# EAGLE design uStar (EAGLE 7.5.0)
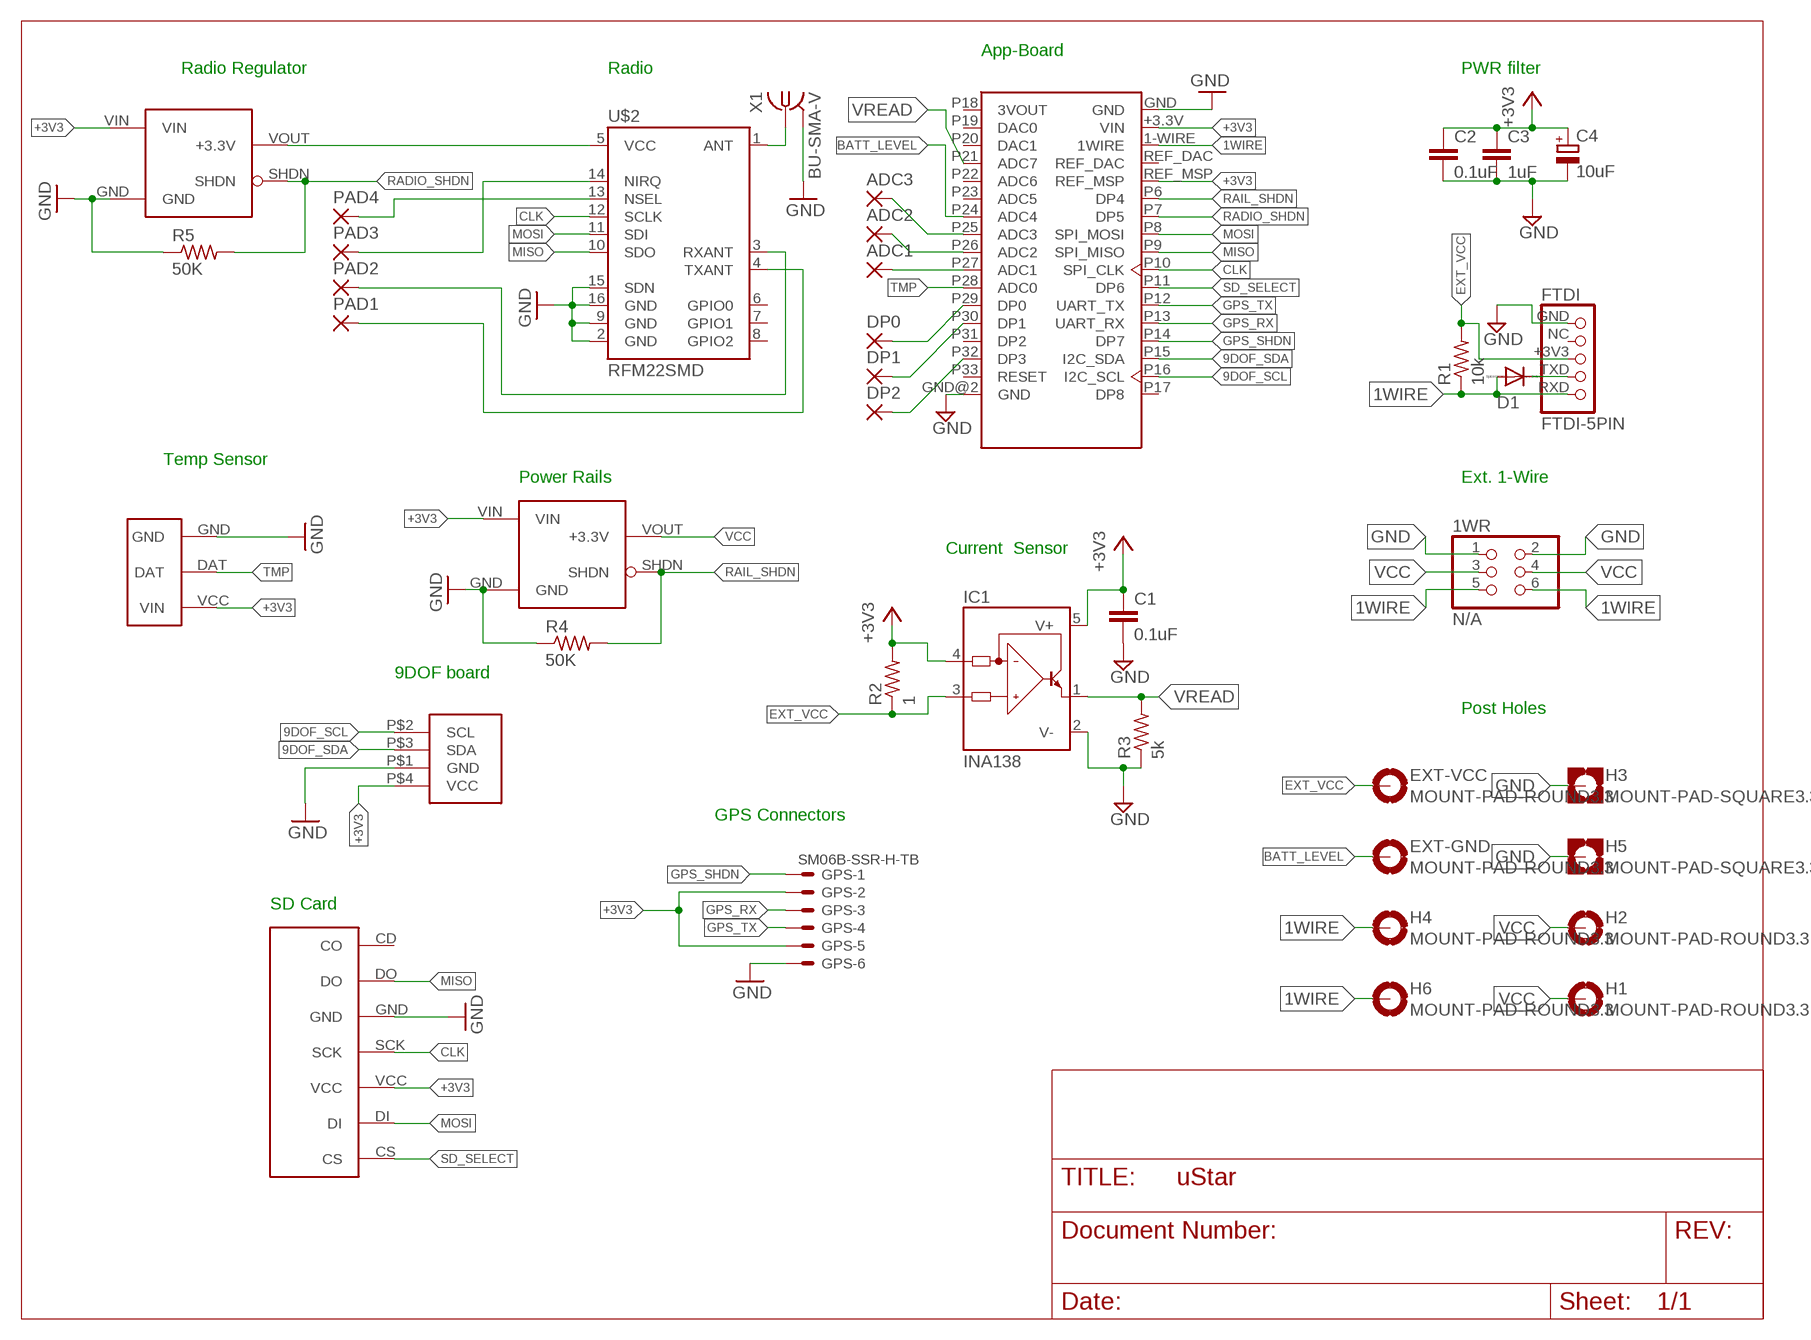
[diagram p0: schematic, sheet 1]

## Parts
1WR  N/A  PINHD-2X3  [2X03]
ADC1  1,6/0,9  [1,6/0,9]
ADC2  1,6/0,9  [1,6/0,9]
ADC3  1,6/0,9  [1,6/0,9]
C1  0.1uF  C-EUC0805  [C0805]
C2  0.1uF  C-EUC0603  [C0603]
C3  1uF  C-EUC0603  [C0603]
C4  10uF  CPOL-EUSMCB  [SMC_B]
D1  1N4148DO35-7  [DO35-7]
DP0  1,6/0,9  [1,6/0,9]
DP1  1,6/0,9  [1,6/0,9]
DP2  1,6/0,9  [1,6/0,9]
EXT-GND  MOUNT-PAD-ROUND3.3  [3,3-PAD]
EXT-VCC  MOUNT-PAD-ROUND3.3  [3,3-PAD]
FTDI  FTDI-5PIN  [1_05X2MM]
GPS  SM06B-SSR-H-TB  [SM06B-SSR-H-TB]
H1  MOUNT-PAD-ROUND3.3  [3,3-PAD]
H2  MOUNT-PAD-ROUND3.3  [3,3-PAD]
H3  MOUNT-PAD-SQUARE3.3  [3,3-PAD-SQUARE]
H4  MOUNT-PAD-ROUND3.3  [3,3-PAD]
H5  MOUNT-PAD-SQUARE3.3  [3,3-PAD-SQUARE]
H6  MOUNT-PAD-ROUND3.3  [3,3-PAD]
IC1  INA138  [SOT23-5]
PAD1  1,6/0,9  [1,6/0,9]
PAD2  1,6/0,9  [1,6/0,9]
PAD3  1,6/0,9  [1,6/0,9]
PAD4  1,6/0,9  [1,6/0,9]
R1  10k  R-US_0207/7  [0207/7]
R2  1  R-US_R0603  [R0603]
R3  5k  R-US_R0603  [R0603]
R4  50K  R-US_R0603  [R0603]
R5  50K  R-US_R0603  [R0603]
U$1  App-Board 1.2/1.3  APP_CORE  [APPCORE_RECEIVER]
U$2  RFM22SMD  [RFM22-XXX-S2]
U$3  S7V8F3_VOLT_REG-3V3_1AHORZ-DOWN  [S7V_DOWN]
U$4  TMP_EXT  [TMP_EXT]
U$5  9DOF  [9DOF]
U$6  SDCARD_EXT  [SDCARD_EXT]
U$7  S7V8F3_VOLT_REG-3V3_1AHORZ-DOWN  [S7V_DOWN]
X1  BU-SMA-V  [BU-SMA-V]

## Nets
1WIRE: 1WR.5 1WR.6 D1.A FTDI.RXD H4.B3,3(MOUNT) H6.B3,3(MOUNT) R1.1 U$1.1-WIRE(1WIRE)
9DOF_SCL: U$1.P16(I2C_SCL) U$5.P$2(SCL)
9DOF_SDA: U$1.P15(I2C_SDA) U$5.P$3(SDA)
+3V3: C1.1 C2.1 C3.1 C4.+ GPS.2 GPS.5 IC1.4(IN-) IC1.5(V+) R2.2 U$1.+3.3V(VIN) U$1.REF_MSP U$3.VIN U$4.VCC(VIN) U$5.P$4(VCC) U$6.VCC U$7.VIN
BATT_LEVEL: EXT-GND.B3,3(MOUNT) U$1.P24(ADC4)
CLK: U$1.P10(SPI_CLK) U$2.12(SCLK) U$6.SCK
EXT_VCC: EXT-VCC.B3,3(MOUNT) FTDI.+3V3 IC1.3(IN+) R1.2 R2.1
GND: 1WR.1 1WR.2 C1.2 C2.2 C3.2 C4.- FTDI.GND GPS.6 H3.B3,3(MOUNT) H5.B3,3(MOUNT) IC1.2(V-) R3.1 R4.1 R5.1 U$1.GND U$1.GND@2(GND) U$2.2(GND) U$2.9(GND) U$2.15(SDN) U$2.16(GND) U$3.GND U$4.GND U$5.P$1(GND) U$6.GND U$7.GND X1.2 X1.3 X1.4 X1.5
GPS_RX: GPS.3 U$1.P13(UART_RX)
GPS_SHDN: GPS.1 U$1.P14(DP7)
GPS_TX: GPS.4 U$1.P12(UART_TX)
MISO: U$1.P9(SPI_MISO) U$2.10(SDO) U$6.DO
MOSI: U$1.P8(SPI_MOSI) U$2.11(SDI) U$6.DI
N$1: PAD1.1(P) U$2.4(TXANT)
N$2: PAD2.1(P) U$2.3(RXANT)
N$3: D1.C FTDI.TXD
N$4: PAD3.1(P) U$2.14(NIRQ)
N$5: PAD4.1(P) U$2.13(NSEL)
N$6: U$2.1(ANT) X1.1
N$7: U$2.5(VCC) U$3.VOUT(+3.3V)
N$8: ADC1.1(P) U$1.P27(ADC1)
N$9: ADC2.1(P) U$1.P26(ADC2)
N$10: ADC3.1(P) U$1.P25(ADC3)
N$11: DP0.1(P) U$1.P29(DP0)
N$12: DP1.1(P) U$1.P30(DP1)
N$13: DP2.1(P) U$1.P32(DP3)
RADIO_SHDN: R5.2 U$1.P7(DP5) U$3.SHDN
RAIL_SHDN: R4.2 U$1.P6(DP4) U$7.SHDN
SD_SELECT: U$1.P11(DP6) U$6.CS
TMP: U$1.P28(ADC0) U$4.DAT
VCC: 1WR.3 1WR.4 H1.B3,3(MOUNT) H2.B3,3(MOUNT) U$7.VOUT(+3.3V)
VREAD: IC1.1(OUT) R3.2 U$1.P21(ADC7)
Unconnected: FTDI.NC U$1.P17(DP8) U$1.P18(3VOUT) U$1.P19(DAC0) U$1.P20(DAC1) U$1.P22(ADC6) U$1.P23(ADC5) U$1.P31(DP2) U$1.P33(RESET) U$1.REF_DAC U$2.6(GPIO0) U$2.7(GPIO1) U$2.8(GPIO2) U$6.CD(CO)

## Notes on the sheet
- App-Board
- Radio Regulator | Radio | PWR filter
- Temp Sensor
- Power Rails | Ext. 1-Wire
- Current  Sensor
- 9DOF board
- Post Holes
- GPS Connectors
- SD Card

## Library data of the parts
1WR = pinhead:PINHD-2X3: PIN HEADER
ADC1-ADC3 DP0 DP1 DP2 PAD1-PAD4 = wirepad:1,6/0,9: THROUGH-HOLE PAD
C1-C3 = resistor:C-EU: CAPACITOR, European symbol
C4 = resistor:CPOL-EU: POLARIZED CAPACITOR, European symbol
D1 = diode:1N4148: DIODE high speed (Philips)
EXT-GND EXT-VCC H1 H2 H4 H6 = holes:MOUNT-PAD-ROUND: MOUNTING PAD, round
FTDI = FTDI:FTDI-5PIN
GPS = con-jst2:SM06B-SSR-H-TB: Disconnectable Insulation displacement connector, 1.0mm pitch 6 contacts
H3 H5 = holes:MOUNT-PAD-SQUARE: MOUNTING PAD, square
IC1 = burr-brown:INA138: High-Side Measurement Current Shunt Monitor; MF: TEXAS INSTRUMENTS; MPN: INA138NA/250; OC_FARNELL: 1564888; OC_NEWARK: 80K5906
R1-R3 = resistor:R-US_: RESISTOR, American symbol
R4 R5 = rcl:R-US_: RESISTOR, American symbol
U$1 = LearningByMaking2:APP_CORE
U$2 = SparkFun-RF:RFM22: The RFM22 is a low-power, low cost radio that is capable of operating in the 434MHz and 900MHz open bands. It's frequency is software defined and there are some very good libraries written for it.
U$3 U$7 = Pololu:S7V8F3_VOLT_REG-3V3_1A
U$4 = LearningByMaking:TMP_EXT
U$5 = LearningByMaking:9DOF
U$6 = LearningByMaking:SDCARD_EXT
X1 = con-coax:BU-SMA-V: FEMALE SMA CONNECTOR Radiall distributor RS 112-3794; OC_FARNELL: unknown; OC_NEWARK: unknown

## Board
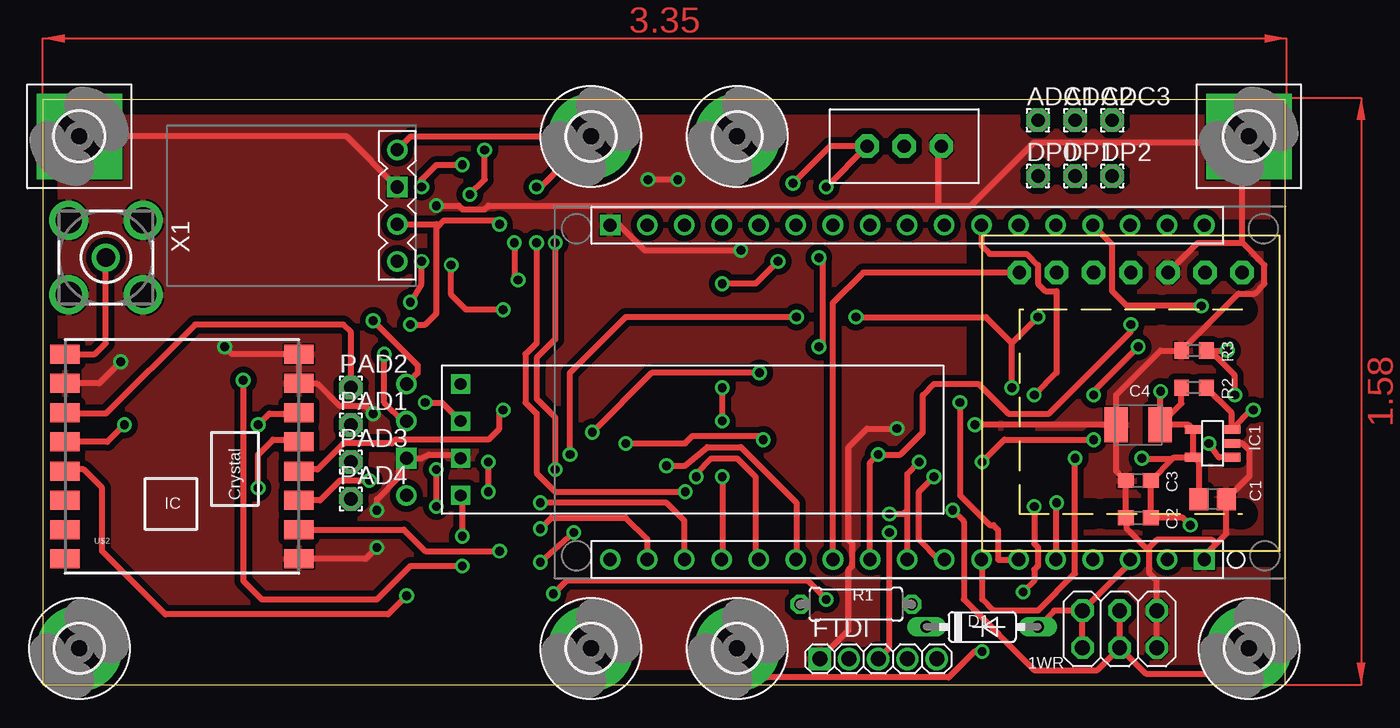
[diagram p1: board, top side]
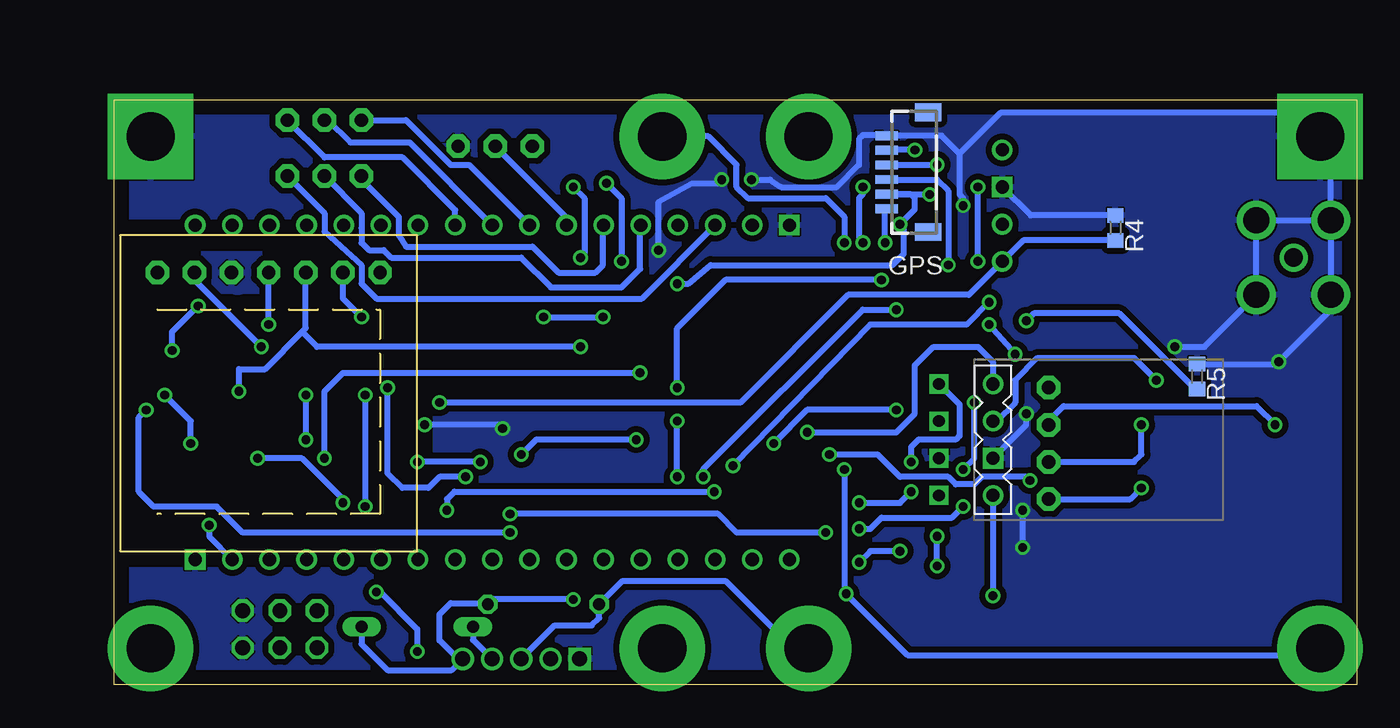
[diagram p2: board, bottom side, seen from below]

Size 85 x 40 mm. Coordinates in mm from the lower left corner, seen from the top.
Outline: 0,0 85,0 85,40 0,40 0,0
Copper layers (1*16): Top 0.035mm / dielectric 1.5mm / Bottom 0.035mm
Design rules "default *": minimum track width 10mil, minimum drill 19mil, track to track 8mil, track to pad 8mil, pad to pad 8mil, via to via 8mil, smd to smd 8mil, copper to edge 40mil, drill to drill 8mil, minimum pad ring 10mil, minimum via ring 8mil, stop-mask expansion 4mil, vias tented up to drill 0mil, thermal gap 5mil

### Footprints (pad centres in the part's own frame; a part is rotated, then mirrored left to right if it is on the bottom)
2X03 = drill 1.016 octagon: 1 -2.54,-1.27; 2 -2.54,1.27; 3 0,-1.27; 4 0,1.27; 5 2.54,-1.27; 6 2.54,1.27
1,6/0,9 = drill 0.914 pad 1.6 octagon: 1 0,0
C0805 = smd 1.3 x 1.5: 1 -0.95,0; 2 0.95,0
C0603 = smd 1.1 x 1: 1 -0.85,0; 2 0.85,0
SMC_B = smd 1.6 x 2.4: + -1.5,0; - 1.5,0
DO35-7 = drill 0.813 long: A 3.81,0; C -3.81,0
3,3-PAD = drill 3.3 pad 5.842: B3,3 0,0
1_05X2MM = drill 1.016 pad 1.3: +3V3 0,0; NC -2,0; RXD 4,0; TXD 2,0 | drill 1.016 pad 1.3 square: GND -4,0
SM06B-SSR-H-TB = smd 0.6 x 1.55: 1 -2.5,1.925; 2 -1.5,1.925; 3 -0.5,1.925; 4 0.5,1.925; 5 1.5,1.925; 6 2.5,1.925 | smd 1.2 x 1.8: FIT@1 -4.1,-0.9; FIT@2 4.1,-0.9
3,3-PAD-SQUARE = drill 3.3 pad 5.842 square: B3,3 0,0
SOT23-5 = smd 0.6 x 1.2: 1 -0.95,-1.306; 2 0,-1.306; 3 0.95,-1.306; 4 0.95,1.306; 5 -0.95,1.306
0207/7 = drill 0.813 octagon: 1 -3.81,0; 2 3.81,0
R0603 = smd 1 x 1.1: 1 -0.85,0; 2 0.85,0
APPCORE_RECEIVER = drill 0.9: 1-WIRE 11.43,14.37; +3.3V 11.43,16.91; P6 11.43,6.75; P7 11.43,4.21; P8 11.43,1.67; P9 11.43,-0.87; P10 11.43,-3.41; P11 11.43,-5.95; P12 11.43,-8.49; P13 11.43,-11.03; P14 11.43,-13.57; P15 11.43,-16.11; P16 11.43,-18.65; P17 11.43,-21.19; P18 -11.43,19.45; P19 -11.43,16.91; P20 -11.43,14.37; P21 -11.43,11.83; P22 -11.43,9.29; P23 -11.43,6.75; P24 -11.43,4.21; P25 -11.43,1.67; P26 -11.43,-0.87; P27 -11.43,-3.41; P28 -11.43,-5.95; P29 -11.43,-8.49; P30 -11.43,-11.03; P31 -11.43,-13.57; P32 -11.43,-16.11; P33 -11.43,-18.65; REF_DAC 11.43,11.83; REF_MSP 11.43,9.29 | drill 0.9 square: GND 11.43,19.45; GND@2 -11.43,-21.19
RFM22-XXX-S2 = smd 2 x 1.3: 1 -8,7; 2 -8,5; 3 -8,3; 4 -8,1; 5 -8,-1; 6 -8,-3; 7 -8,-5; 8 -8,-7; 9 8,-7; 10 8,-5; 11 8,-3; 12 8,-1; 13 8,1; 14 8,3; 15 8,5; 16 8,7
S7V_DOWN = drill 0.9 square: GND 1.27,-7.23 | drill 0.9: SHDN -3.81,-7.23; VIN -1.27,-7.23; VOUT 3.81,-7.23
TMP_EXT = drill 0.914 pad 1.6 octagon: DAT 0,0; GND 2.54,0; VCC -2.54,0
9DOF = drill 0.8 square: P$1 0,-1.27; P$2 0,1.27; P$3 0,3.81; P$4 0,-3.81
SDCARD_EXT = drill 0.914 pad 1.6 octagon: CD 7.62,-8.89; CS -7.62,-8.89; DI -5.08,-8.89; DO 5.08,-8.89; GND 2.54,-8.89; SCK 0,-8.89; VCC -2.54,-8.89
BU-SMA-V = drill 1.27: 1 0,0 | drill 1.778: 2 -2.55,2.55; 3 2.55,2.55; 4 2.55,-2.55; 5 -2.55,-2.55

### Placement (x,y rotation side)
1WR  73.66,3.81 180 top
ADC1  68.07,38.61 0 top
ADC2  70.61,38.61 0 top
ADC3  73.15,38.61 0 top
C1  80.01,12.7 0 top
C2  74.93,11.43 180 top
C3  74.93,13.97 180 top
C4  74.93,17.78 180 top
D1  64.26,3.96 0 top
DP0  68.07,34.8 0 top
DP1  70.61,34.8 0 top
DP2  73.15,34.8 0 top
EXT-GND  47.5,2.5 0 top
EXT-VCC  37.5,2.5 0 top
FTDI  57.15,1.78 0 top
GPS  30.23,35.05 90 bottom
H1  82.5,2.5 0 top
H2  37.5,37.5 0 top
H3  82.5,37.5 0 top
H4  47.5,37.5 0 top
H5  2.5,37.5 0 top
H6  2.5,2.5 0 top
IC1  80.01,16.51 90 top
PAD1  21.08,17.78 0 top
PAD2  21.08,20.32 0 top
PAD3  21.08,15.24 0 top
PAD4  21.08,12.7 0 top
R1  55.63,5.51 180 top
R2  78.74,20.32 180 top
R3  78.74,22.86 0 top
R4  16.51,31.24 270 bottom
R5  10.92,21.08 270 bottom
U$1  60,20 270 top
U$2  9.53,15.62 0 top
U$3  17.65,16.76 270 bottom
U$4  58.93,36.83 0 top
U$5  28.57,16.76 0 top
U$6  74.42,19.3 180 bottom
U$7  17.02,32.77 90 top
X1  4.32,29.21 270 top

### Tracks (layer width: path | path; a pad name or v marks a point on that pad's centre or on a via)
1WIRE  (via drill 0.6)
  Top 0.406: v35.05,30.23 35.05,23.62 33.78,22.35 33.78,19.56 35.05,18.29 v35.05,14.73 | U$1.1-WIRE 74.37,8.33 1WR.5 | 1WR.5 69.19,5.08 D1.A | 1WR.6 1WR.5 | v53.59,5.84 52.32,7.11 35.81,7.11 v34.92,6.22
  Bottom 0.406: v35.05,30.23 35.05,32 36.32,33.27 41.66,33.27 42.42,34.04 42.42,35.56 44.36,37.5 H4.B3,3 | v35.05,14.73 35.05,6.35 v34.92,6.22 30.73,2.03 2.97,2.03 H6.B3,3 | D1.A 68.07,2.79 66.29,1.02 61.91,1.02 FTDI.RXD 61.47,1.78 62.74,3.05 62.74,4.83 61.98,5.59 59.51,5.59 R1.1 59.11,5.84 v53.59,5.84
9DOF_SCL  (via drill 0.6)
  Top 0.406: U$1.P16 41.35,9.96 39.88,11.43 34.8,11.43 v34.04,10.67 | v26.92,12.19 v26.92,14.73 | v26.16,19.3 27.3,19.3 U$5.P$2
  Bottom 0.406: v34.04,10.67 33.27,10.67 32.51,11.43 27.69,11.43 v26.92,12.19 | v26.16,19.3 26.16,15.49 v26.92,14.73
9DOF_SDA  (via drill 0.6)
  Top 0.406: U$1.P15 43.89,11.23 42.67,12.45 v34.04,12.45 | v30.48,13.21 v30.48,15.24
  Bottom 0.406: v34.04,12.45 31.24,12.45 v30.48,13.21 | 30.48,15.49 v30.48,15.24 30.48,16.26 29.97,16.76 27.43,16.76 27.18,17.02 27.18,19.18 U$5.P$3
+3V3  (via drill 0.6)
  Top 0.406: 77.26,15.45 C3.1 C2.1 77.98,11.43 v78.49,10.92 | 77.26,15.45 77.37,15.56 IC1.5 | IC1.5 IC1.4 78.38,17.78 C4.+ | C4.+ 77.89,19.24 R2.2 | IC1.5 79.06,15.2 C1.1 | C4.+ 76.43,20.04 v76.45,20.07 | U$3.VIN 24.64,18.03 23.37,19.3 v23.37,22.61 | v25.15,24.64 26.16,24.64 26.92,25.4 26.92,31.24 | 26.92,31.24 27.43,31.75 30.99,31.75 v31.24,31.5 | v13.72,20.83 13.72,7.11 14.99,5.84 22.86,5.84 25.15,8.13 v28.7,8.13 | v28.7,10.16 28.7,12.83 U$5.P$4 | U$1.REF_MSP 69.34,8.62 v69.34,12.45 | v75.18,15.49 75.23,15.45 77.26,15.45 | v50.29,28.96 48.77,27.43 v46.48,27.43 | v53.59,34.04 U$4.VCC 53.85,36.83 v51.31,34.29 | v53.09,29.21 53.34,28.96 53.34,23.37 v53.09,23.11 | U$7.VIN 26.92,31.5 26.92,31.24 | v29.21,33.53 30.23,34.54 v30.23,36.58
  Bottom 0.406: v76.45,20.07 76.45,21.59 74.68,21.59 72.14,24.13 | v23.37,22.61 v25.15,24.64 | v13.72,20.83 15.24,22.35 21.84,22.35 23.37,20.83 23.37,19.3 24.64,18.03 U$3.VIN | v28.7,8.13 v28.7,10.16 | v69.34,12.45 69.34,12.7 72.14,15.49 v75.18,15.49 | v50.29,28.96 50.29,33.27 v51.31,34.29 | v46.48,27.43 45.72,27.43 44.2,28.7 31.75,28.7 30.99,29.46 30.99,31.24 v31.24,31.5 30.23,32.51 30.23,33.27 30.48,33.53 32.13,33.53 GPS.2 29.23,33.55 v29.21,33.53 | 72.14,24.13 71.88,24.38 U$6.VCC | v53.59,34.04 52.83,33.27 52.83,29.46 v53.09,29.21 | v53.09,23.11 71.12,23.11 72.14,24.13 | v30.23,36.58 32.13,36.58 GPS.5 | v78.49,10.92 78.49,10.15 U$1.+3.3V
BATT_LEVEL  (via drill 0.6)
  Top 0.406: U$1.P24 64.21,30.02 64.77,29.46 67.31,29.46 68.07,28.7 68.07,27.43 68.58,26.92 69.34,26.92 69.34,21.34 v67.82,19.81 | v67.82,12.19 67.82,9.65 68.07,9.4 68.07,8.13 67.82,7.87 67.82,7.11 v67.06,6.35 | v64.26,2.29 63.75,2.29 61.98,0.51 49.49,0.51 EXT-GND.B3,3
  Bottom 0.406: v67.82,19.81 v67.82,12.19 | v67.06,6.35 66.8,6.35 64.26,3.81 v64.26,2.29
CLK  (via drill 0.6)
  Top 0.406: v31.5,18.8 31.24,18.54 31.24,17.53 30.48,16.76 24.13,16.76 23.88,16.51 20.57,16.51 18.8,14.73 17.64,14.73 U$2.12 | v39.88,16.51 43.94,16.51 44.45,17.02 49.02,17.02 v49.28,16.76 | U$1.P10 56.59,15.19 v57.15,15.75 58.67,15.75 60.2,17.27 60.2,19.81 60.96,20.57 64.01,20.57 66.04,18.54 68.83,18.54 74.42,24.13 v74.42,24.64
  Bottom 0.406: v31.5,18.8 37.59,18.8 v39.88,16.51 | v49.28,16.76 56.13,16.76 v57.15,15.75 | v74.42,24.64 U$6.SCK
EXT_VCC  (via drill 0.6)
  Top 0.406: FTDI.+3V3 57.91,2.54 v57.91,10.41 | v82.8,18.8 82.65,18.8 IC1.3 81.32,18.59 R2.1
  Bottom 0.406: v57.91,10.41 76.2,10.41 77.98,12.19 82.3,12.19 83.31,13.21 83.31,18.29 v82.8,18.8 | FTDI.+3V3 54.86,4.06 52.32,4.06 51.82,4.57 R1.2 50.22,7.11 43.18,7.11 38.57,2.5 EXT-VCC.B3,3
GND  (via drill 0.6)
  Top 0.406: U$7.GND 20.78,37.5 H5.B3,3 | v26.92,32.77 28.45,32.77 28.7,32.51 30.23,32.51 30.48,32.77 61.21,32.77 | 61.21,32.77 63.5,32.77 67.82,37.08 82.04,37.08 82.46,37.5 H3.B3,3 82.04,37.04 82.04,30.23 | FTDI.GND 55.12,3.75 55.12,7.87 55.37,8.13 55.37,9.65 55.12,9.91 55.12,16.26 56.39,17.53 v58.42,17.53 | 1WR.2 1WR.1 76.2,7.11 75.69,7.62 75.69,9.14 75.56,9.27 | 75.56,9.27 74.17,10.67 74.17,11.34 C2.2 C3.2 73.43,14.62 C4.- | C4.- 73.43,19.84 76.45,22.86 R3.1 81.79,26.76 82.89,26.76 83.57,27.43 83.57,28.7 82.04,30.23 | IC1.2 82.04,16.51 82.55,16 82.55,14.29 C1.2 80.96,10.35 80.26,9.65 | C4.- v63.75,17.78 | U$4.GND 61.21,36.58 61.21,32.77 | U$1.GND@2 39.44,31.43 41.15,29.72 v47.75,29.72 | v43.43,34.54 v41.4,34.54 | v22.86,9.4 22.08,8.62 U$2.9 | U$5.P$1 28.07,15.75 26.42,15.75 25.91,15.49 U$3.GND 24.38,14.99 24.38,14.22 22.86,12.7 v22.86,11.94 | v22.61,18.54 22.1,19.05 20.32,19.05 18.8,20.57 17.57,20.57 U$2.15 U$2.16 12.94,22.62 v12.45,23.11 | v5.33,22.1 3.86,20.62 U$2.2 | U$1.GND 79.45,8.84 80.26,9.65 | U$6.GND 78.99,30.23 82.04,30.23 | 80.26,9.65 80.01,9.91 76.2,9.91 75.56,9.27
  Bottom 0.406: 27.18,36.32 24.38,39.12 4.12,39.12 H5.B3,3 1.77,36.77 X1.5 | 27.18,36.32 27.18,33.53 26.92,33.27 v26.92,32.77 | 27.18,36.32 28.41,37.55 GPS.6 32.19,37.59 33.78,37.59 34.04,37.34 34.04,35.56 35.56,34.04 39.37,34.04 40.13,34.54 v41.4,34.54 | v47.75,29.72 47.75,33.02 45.47,34.29 43.69,34.29 v43.43,34.54 | v22.86,11.94 v22.86,9.4 | U$3.GND 22.61,17.77 v22.61,18.54 | v12.45,23.11 10.41,23.11 X1.3 X1.2 X1.5 | X1.5 X1.4 1.77,25.66 v5.33,22.1 5.5,21.93 R5.1 | v58.42,17.53 58.67,17.78 v63.75,17.78 | R4.1 22.3,32.09 U$7.GND
  pour Bottom (isolate 0.406): 0,0 0,40.13 85.09,40.13 85.09,38.35 85.09,0
  pour Top (isolate 0.406): 0,0 0,40.13 85.09,40.13 85.09,37.85 85.09,0
GPS_RX  (via drill 0.6)
  Top 0.406: v44.7,14.22 44.7,14.48 45.72,15.49 47.5,15.49 48.77,14.22 48.77,8.77 U$1.P13 | v31.5,25.65 28.96,25.65 27.94,26.67 v27.94,28.7
  Bottom 0.406: GPS.3 28.71,34.55 27.94,33.78 v27.94,28.7 | v44.7,14.22 44.7,14.73 33.78,25.65 v31.5,25.65
GPS_SHDN  (via drill 0.6)
  Top 0.406: v32.26,30.23 32.26,27.94 v32.51,27.69 | v46.48,14.22 46.48,8.62 U$1.P14 | v46.48,18.03 v46.48,20.32
  Bottom 0.406: v32.51,27.69 43.18,27.69 46.48,24.38 v46.48,20.32 | v32.26,30.23 32.26,32.45 GPS.1 | v46.48,14.22 v46.48,18.03
GPS_TX  (via drill 0.6)
  Top 0.406: v42.67,14.99 43.94,14.99 45.47,16.26 47.75,16.26 51.56,12.45 51.56,8.62 U$1.P12 | v25.15,26.16 25.91,27.43 v25.91,28.96 | v25.91,34.04 25.91,34.54 26.92,35.56 v28.7,35.56
  Bottom 0.406: GPS.4 v28.71,35.55 v28.7,35.56 | v42.67,14.99 33.27,24.64 26.67,24.64 v25.15,26.16 | v25.91,28.96 v25.91,34.04
MISO  (via drill 0.6)
  Top 0.406: U$1.P9 59.13,11.94 | 59.13,11.94 59.13,14.43 v59.94,15.24 | U$2.10 24.68,10.62 26.16,9.14 v31.24,9.14 | v34.04,8.38 v36.32,10.41 | v57.91,11.68 58.88,11.68 59.13,11.94 | v74.93,23.11 71.88,20.07 v71.88,19.81 | v64.26,15.24 65.79,16.76 v71.88,16.76
  Bottom 0.406: v59.94,15.24 v64.26,15.24 | v57.91,11.68 43.69,11.68 42.42,10.41 v36.32,10.41 | v31.24,9.14 33.27,9.14 v34.04,8.38 | U$6.DO 79.5,27.69 v74.93,23.11 | v71.88,19.81 v71.88,16.76
MOSI  (via drill 0.6)
  Top 0.406: U$1.P8 61.28,8.57 59.94,9.91 59.94,13.21 v60.96,14.22 | v66.29,20.32 66.29,23.37 | v51.56,25.15 39.88,25.15 36.07,21.34 v36.07,15.75 | v22.35,13.97 20.32,13.97 18.97,12.62 U$2.11 | v55.63,25.15 64.52,25.15 66.29,23.37 | 66.29,23.37 v68.07,25.15
  Bottom 0.406: v60.96,14.22 62.74,14.22 63.5,13.46 65.28,13.46 66.29,14.48 v66.29,20.32 | v55.63,25.15 v51.56,25.15 | v36.07,15.75 32.77,15.75 31.24,14.22 27.94,14.22 27.43,13.72 26.16,13.72 25.65,14.22 22.61,14.22 v22.35,13.97 | v68.07,25.15 69.34,26.42 U$6.DI
N$1  (via drill 0.6)
  Top 0.406: v5.59,17.78 4.43,16.62 U$2.4
  Bottom 0.406: PAD1.1 21.08,18.03 20.07,19.05 6.86,19.05 v5.59,17.78
N$2
  Top 0.406: PAD2.1 21.08,24.13 20.57,24.64 10.41,24.64 4.32,18.54 1.6,18.54 U$2.3
N$3
  Bottom 0.406: D1.C 60.45,3.08 FTDI.TXD
N$4  (via drill 0.6)
  Top 0.406: v14.73,17.78 15.49,18.54 17.45,18.54 U$2.14
  Bottom 0.406: PAD3.1 15.24,15.24 14.73,15.75 v14.73,17.78
N$5  (via drill 0.6)
  Top 0.406: 18.03,16.51 17.64,16.51 U$2.13 17.38,16.76 15.75,16.76 14.73,15.75 v14.73,13.46
  Bottom 0.406: PAD4.1 15.49,12.7 v14.73,13.46
N$6
  Top 0.406: U$2.1 3.57,22.62 4.32,23.37 X1.1
N$7  (via drill 0.6)
  Top 0.406: v24.89,6.1 23.62,4.83 8.38,4.83 4.06,9.14 4.06,13.46 2.79,14.73 1.64,14.73 U$2.5
  Bottom 0.406: U$3.VOUT 24.89,12.95 v24.89,6.1
N$8
  Bottom 0.406: ADC1.1 65.02,38.61 61.98,35.56 60.72,35.56 U$1.P27
N$9
  Bottom 0.406: U$1.P26 64.78,37.08 68.83,37.08 70.36,38.61 ADC2.1
N$10
  Bottom 0.406: U$1.P25 61.67,32.46 65.28,36.07 70.61,36.07 ADC3.1
N$11
  Bottom 0.406: DP0.1 68.07,34.54 65.53,32 65.53,30.73 65.02,29.97 56.39,29.97 54.61,28.19 52.07,28.19 51.56,28.7 51.56,31.38 U$1.P29
N$12
  Bottom 0.406: DP1.1 68.07,32.26 68.07,31.24 68.07,30.73 68.07,30.23 67.56,29.72 66.55,29.72 66.04,29.21 57.15,29.21 55.12,27.18 50.29,27.18 49.02,28.45 49.02,31.38 U$1.P30
N$13
  Bottom 0.406: DP2.1 70.61,32.26 70.61,30.99 68.07,28.7 68.07,27.43 67.06,26.42 48.9,26.42 U$1.P32
RADIO_SHDN  (via drill 0.6)
  Top 0.406: v70.61,15.49 70.61,7.62 68.07,5.08 65.02,5.08 64.26,5.84 64.26,8.52 U$1.P7 | v49.02,21.34 41.66,21.34 v37.59,17.27 | v22.61,24.89 25.65,21.84 25.65,21.34 24.89,20.57 U$3.SHDN
  Bottom 0.406: v70.61,15.49 70.61,20.07 69.34,21.34 v49.02,21.34 | v37.59,17.27 31.5,17.27 30.23,18.54 30.23,21.84 28.96,23.11 25.91,23.11 24.89,22.1 24.89,20.58 U$3.SHDN | R5.2 11.09,20.23 16.26,25.4 22.1,25.4 v22.61,24.89
RAIL_SHDN  (via drill 0.6)
  Top 0.406: v62.74,19.3 62.74,13.46 62.74,12.95 64.77,10.92 65.02,10.92 65.34,10.6 65.34,8.57 U$1.P6
  Bottom 0.406: v62.74,19.3 42.16,19.3 34.8,26.67 26.53,26.67 U$7.SHDN 22.81,30.39 R4.2
SD_SELECT
  Top 0.406: U$1.P11 54.05,26.11 56.13,28.19 U$6.CS
TMP
  Bottom 0.406: U$4.DAT 54.05,31.95 U$1.P28
VCC  (via drill 0.6)
  Top 0.406: U$7.VOUT 25.17,37.5 H2.B3,3 34.04,34.04 v33.78,34.04 | 1WR.4 72.14,1.02 67.82,1.02 62.99,5.84 62.99,11.18 v62.23,11.94 | 1WR.4 1WR.3 | 1WR.4 75.44,0.76 80.76,0.76 H1.B3,3 | v33.78,30.23 33.78,23.37 33.02,22.61 33.02,19.3 33.78,18.54 33.78,14.48 35.05,13.21 v43.94,13.21
  Bottom 0.406: v33.78,34.04 33.78,33.53 34.04,33.27 34.04,30.48 v33.78,30.23 | v62.23,11.94 62.23,12.7 61.72,13.21 v43.94,13.21
VREAD  (via drill 0.6)
  Top 0.406: IC1.1 80.45,15.56 v79.76,16.51 | v81.53,19.81 81.53,21.17 79.84,22.86 R3.2 v81.03,22.86 | 71.88,31.38 U$1.P21 73.15,30.11 73.15,26.92 74.17,25.91 v79.25,25.91
  Bottom 0.406: v79.76,16.51 79.76,18.03 v81.53,19.81 | v81.03,22.86 81.03,24.13 v79.25,25.91
(copper drawn outside any net)
  shapes: Top area x2